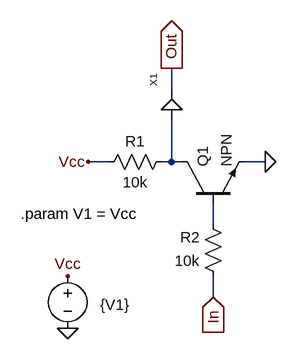
[diagram p0: schematic NOT.asc]
NOT.asc, the LTspice schematic file:
Version 4
SHEET 1 880 680
WIRE 112 16 112 -16
WIRE 16 128 -16 128
WIRE 112 128 112 64
WIRE 112 128 96 128
WIRE 128 128 112 128
WIRE 256 128 224 128
WIRE 176 224 176 192
WIRE 176 336 176 304
FLAG 176 336 In
IOPIN 176 336 In
FLAG 112 -16 Out
IOPIN 112 -16 Out
FLAG -48 384 0
FLAG -48 304 Vcc
FLAG -16 128 Vcc
FLAG 256 128 0
SYMBOL npn 128 192 R270
SYMATTR InstName Q1
SYMBOL res 112 112 R90
WINDOW 0 0 56 VBottom 2
WINDOW 3 32 56 VTop 2
SYMATTR InstName R1
SYMATTR Value 10k
SYMBOL res 192 320 R180
WINDOW 0 36 76 Left 2
WINDOW 3 36 40 Left 2
SYMATTR InstName R2
SYMATTR Value 10k
SYMBOL Buffer 112 64 R270
SYMATTR InstName X1
SYMBOL voltage -48 288 R0
WINDOW 0 24 16 Invisible 2
WINDOW 3 50 60 Left 2
SYMATTR InstName V1
SYMATTR Value {V1}
TEXT -120 208 Left 2 !.param V1 = Vcc

The netlist it stands for:
* NOT.asc
Q1 N001 N002 0 0 NPN
R1 N001 Vcc 10k
R2 In N002 10k
XX1 N001 Out Buffer Vcc = 5V  ; pins In Out
V1 Vcc 0 {V1}
.model NPN NPN
.model PNP PNP
.lib standard.bjt
.param V1 = Vcc
.backanno
.end